# Altium schematic sheet MCU.SchDoc
size A4; Date: 22.07.2025; CheckedBy: Own Checked; CompanyName: No Company; DocumentNumber: ELK.PCB.0001.0001.A.A; Revision: V0.0.1; SheetNumber: 4; SheetTotal: 5
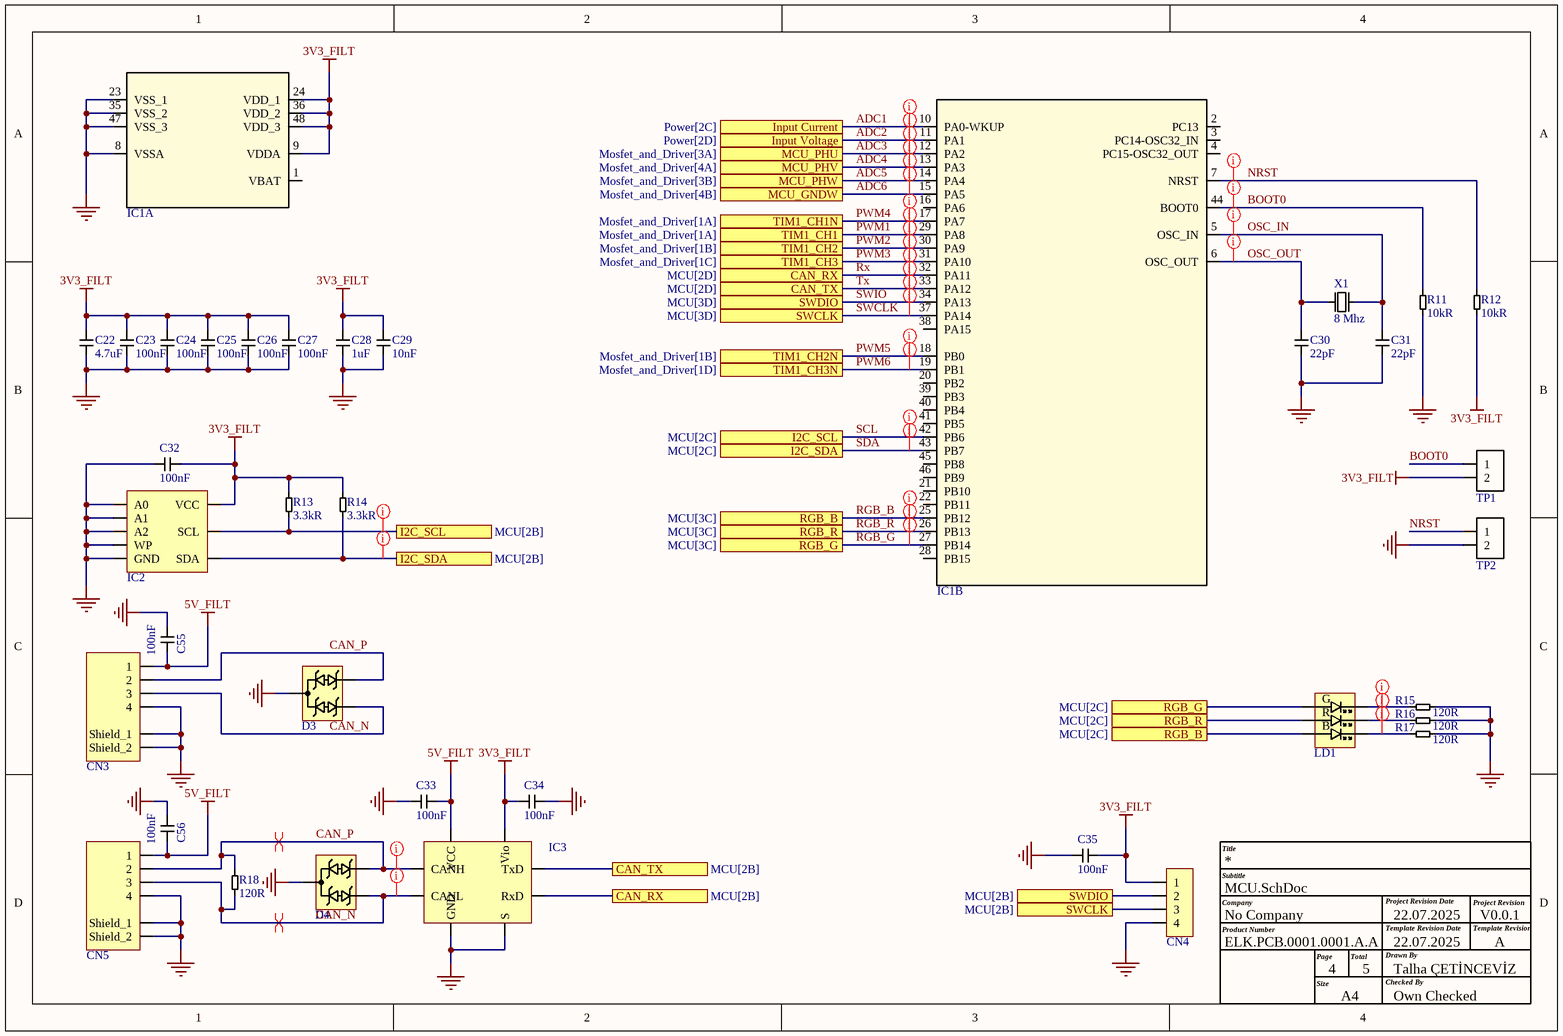
[diagram p0: MCU.SchDoc]

## Parts
C22  value 4.7uF  [CAP 0603]  (hidden comment: CL10A475KO8NNNC)
C23  value 100nF  [CAP 0603]  (hidden comment: CC0603KRX7R9BB104)
C24  value 100nF  [CAP 0603]  (hidden comment: CC0603KRX7R9BB104)
C25  value 100nF  [CAP 0603]  (hidden comment: CC0603KRX7R9BB104)
C26  value 100nF  [CAP 0603]  (hidden comment: CC0603KRX7R9BB104)
C27  value 100nF  [CAP 0603]  (hidden comment: CC0603KRX7R9BB104)
C28  value 1uF  [CAP 0603]  (hidden comment: CL10B105KO8NNNC)
C29  value 10nF  [CAP 0603]  (hidden comment: CL10B103KB8NNNC)
C30  value 22pF  [CAP 0603]  (hidden comment: MCF03JTN500220)
C31  value 22pF  [CAP 0603]  (hidden comment: MCF03JTN500220)
C32  value 100nF  [CAP 0603]  (hidden comment: CC0603KRX7R9BB104)
C33  value 100nF  [CAP 0603]  (hidden comment: CC0603KRX7R9BB104)
C34  value 100nF  [CAP 0603]  (hidden comment: CC0603KRX7R9BB104)
C35  value 100nF  [CAP 0603]  (hidden comment: CC0603KRX7R9BB104)
C55  value 100nF  [CAP 0603]  (hidden comment: CC0603KRX7R9BB104)
C56  value 100nF  [CAP 0603]  (hidden comment: CC0603KRX7R9BB104)
CN3  5024940470  [5024940470]  (value not drawn)
CN4  4 Pin SMD  [4Pin SMD]  (value not drawn)  (no BOM)
CN5  5024940470  [5024940470]  (value not drawn)
D3  PESD1CAN-HT  [SOT23-3]  (value not drawn)
D4  PESD1CAN-HT  [SOT23-3]  (value not drawn)
IC1  STM32F103CBT7TR  [LQFP-48]  (value not drawn)  (parts A,B of 2)
IC2  AT24C128C-SSHM-T  [SOIC-8]  (value not drawn)
IC3  TJA1051T/3,118  [SOIC-8]  (value not drawn)
LD1  HLAF5060H248BS36FU76GCS1  [LED 5050]  (value not drawn)
R11  value 10kR  [RES 0603]  (hidden comment: RC0603FR-0710KL)
R12  value 10kR  [RES 0603]  (hidden comment: RC0603FR-0710KL)
R13  value 3.3kR  [RES 0603]  (hidden comment: 0603SAF3301T5E)
R14  value 3.3kR  [RES 0603]  (hidden comment: 0603SAF3301T5E)
R15  value 120R  [RES 0603]  (hidden comment: 0603SAF1200T5E)
R16  value 120R  [RES 0603]  (hidden comment: 0603SAF1200T5E)
R17  value 120R  [RES 0603]  (hidden comment: 0603SAF1200T5E)
R18  value 120R  [RES 0603]  (hidden comment: 0603SAF1200T5E)
TP1  TP_Mini  [TP]  (value not drawn)  (no BOM)
TP2  TP_Mini  [TP]  (value not drawn)  (no BOM)
X1  value 8 Mhz  [HC-49/US]  (hidden comment: AS-8.000-16-SMD-TR)

## Ports
CAN_RX (see MCU[2B]), CAN_RX (see MCU[2D]), CAN_TX (see MCU[2B]), CAN_TX (see MCU[2D]), I2C_SCL (see MCU[2B]), I2C_SCL (see MCU[2C]), I2C_SDA (see MCU[2B]), I2C_SDA (see MCU[2C]), Input Current (see Power[2C]), Input Voltage (see Power[2D]), MCU_GNDW (see Mosfet_and_Driver[4B]), MCU_PHU (see Mosfet_and_Driver[3A]), MCU_PHV (see Mosfet_and_Driver[4A]), MCU_PHW (see Mosfet_and_Driver[3B]), RGB_B (see MCU[2C]), RGB_B (see MCU[3C]), RGB_G (see MCU[2C]), RGB_G (see MCU[3C]), RGB_R (see MCU[2C]), RGB_R (see MCU[3C]), SWCLK (see MCU[2B]), SWCLK (see MCU[3D]), SWDIO (see MCU[2B]), SWDIO (see MCU[3D]), TIM1_CH1 (see Mosfet_and_Driver[1A]), TIM1_CH1N (see Mosfet_and_Driver[1A]), TIM1_CH2 (see Mosfet_and_Driver[1B]), TIM1_CH2N (see Mosfet_and_Driver[1B]), TIM1_CH3 (see Mosfet_and_Driver[1C]), TIM1_CH3N (see Mosfet_and_Driver[1D])

## Nets
3V3_FILT: C22.2 C23.2 C24.2 C25.2 C26.2 C27.2 C28.2 C29.2 C32.1 C34.2 C35.1 CN4.1 IC1.9(VDDA) IC1.24(VDD_1) IC1.36(VDD_2) IC1.48(VDD_3) IC2.8(VCC) IC3.5(Vio) R12.1 R13.2 R14.2 TP1.2
5V_FILT: C33.1 C55.2 C56.2 CN3.1 CN5.1 IC3.3(VCC)
GND: C22.1 C23.1 C24.1 C25.1 C26.1 C27.1 C28.1 C29.1 C30.1 C31.1 C32.2 C33.2 C34.1 C35.2 C55.1 C56.1 CN3.4 CN3.5(Shield_1) CN3.6(Shield_2) CN4.4 CN5.4 CN5.5(Shield_1) CN5.6(Shield_2) D3.3 D4.3 IC1.8(VSSA) IC1.23(VSS_1) IC1.35(VSS_2) IC1.47(VSS_3) IC2.1(A0) IC2.2(A1) IC2.3(A2) IC2.4(GND) IC2.7(WP) IC3.2(GND) IC3.8(S) R11.1 R15.2 R16.2 R17.2 TP2.2
ADC1: IC1.10(PA0-WKUP) ; port Input Current
ADC2: IC1.11(PA1) ; port Input Voltage
ADC3: IC1.12(PA2) ; port MCU_PHU
ADC4: IC1.13(PA3) ; port MCU_PHV
ADC5: IC1.14(PA4) ; port MCU_PHW
ADC6: IC1.15(PA5) ; port MCU_GNDW
BOOT0: IC1.44(BOOT0) R11.2 TP1.1
CAN_N: CN3.3 CN5.3 D3.2 D4.2 IC3.6(CANL) R18.1
CAN_P: CN3.2 CN5.2 D3.1 D4.1 IC3.7(CANH) R18.2
NRST: IC1.7(NRST) R12.2 TP2.1
OSC_IN: C31.2 IC1.5(OSC_IN) X1.2
OSC_OUT: C30.2 IC1.6(OSC_OUT) X1.1
PWM1: IC1.29(PA8) ; port TIM1_CH1
PWM2: IC1.30(PA9) ; port TIM1_CH2
PWM3: IC1.31(PA10) ; port TIM1_CH3
PWM4: IC1.17(PA7) ; port TIM1_CH1N
PWM5: IC1.18(PB0) ; port TIM1_CH2N
PWM6: IC1.19(PB1) ; port TIM1_CH3N
RGB_B: IC1.25(PB12) LD1.3(Blue_Anode) ; port RGB_B
RGB_G: IC1.27(PB14) LD1.1(Green_Anode) ; port RGB_G
RGB_R: IC1.26(PB13) LD1.2(Red_Anode) ; port RGB_R
Rx: IC1.32(PA11) IC3.4(RxD) ; port CAN_RX
SCL: IC1.42(PB6) IC2.6(SCL) R13.1 ; port I2C_SCL
SDA: IC1.43(PB7) IC2.5(SDA) R14.1 ; port I2C_SDA
SWCLK: CN4.3 IC1.37(PA14) ; port SWCLK
SWIO: CN4.2 IC1.34(PA13) ; port SWDIO
Tx: IC1.33(PA12) IC3.1(TxD) ; port CAN_TX
NetLD1_4: LD1.4(Blue_Cathode) R17.1
NetLD1_5: LD1.5(Red_Cathode) R16.1
NetLD1_6: LD1.6(Green_Cathode) R15.1

Not connected (* = marked no-connect by the designer): IC1 1(VBAT) 2(PC13) 3(PC14-OSC32_IN) 4(PC15-OSC32_OUT) 16(PA6) 20(PB2) 21(PB10) 22(PB11) 28(PB15) 38(PA15) 39(PB3) 40(PB4) 41(PB5) 45(PB8) 46(PB9)

## Layout directives
differential pair: CAN_N, CAN_P
net class 3V3: ADC1, ADC2, ADC3, ADC4, ADC5, ADC6, BOOT0, CAN_N, CAN_P, NetLD1_4, NetLD1_5, NetLD1_6, NRST, OSC_IN, OSC_OUT, PWM1, PWM2, PWM3, PWM4, PWM5, PWM6, RGB_B, RGB_G, RGB_R, Rx, Tx
net class I2C: SCL, SDA, SWCLK, SWIO

## Notes on the sheet
- Title
- Company
- Product Number
- Subtitle
- Project Revision Date
- Template Revision Date
- Project Revision
- Template Revision
- Size
- Page
- A4
- Total
- Checked By
- Drawn By
- 22.07.2025
- Talha ÇETİNCEVİZ
- A
- (in symbol HLAF5060H248BS36FU76GCS1) G; R; B

## Library data of the parts
C22 = CL10A475KO8NNNC: 16V 4.7uF X5R ±10% 0603 Multilayer Ceramic Capacitors MLCC - SMD/SMT ROHS; Manufacturer: Samsung; Supplier: Ozdisan; Supplier Part Number: CL10A475KO8NNNC; Manufacturer Part Number: CL10A475KO8NNNC; RoHS: Yes; Category: Ceramic Capacitors; Stock: 132000; Pricing: 4000=0,0122, 8000=0,01188, 16000=0,01148, 24000=0,01109, 32000=0,01069 (USD); Mounting Technology: Surface Mount; Case/Package: 0603; Case Code (Metric): 1608; Case Code (Imperial): 0603; Material: Ceramic; Min Operating Temperature: -55°C; Max Operating Temperature: 85°C; Tolerance: 10%; Packaging: Tape and Reel; Voltage Rating: 16V; Dielectric: X5R; Voltage: 16V; Series: CL; Construction: Flat; Voltage Rating (DC): 16V; Length: 1.6mm; Height: 0.8mm; Depth: 0.8mm; Radiation Hardening: No; RoHS Compliant: Yes; ComponentLink1URL: https://datasheet.ciiva.com/25795/cl10a475ko8nnnc-25795890.pdf?src-supplier=Digikey; ComponentLink1Description: https://datasheet.ciiva.com/25795/cl10a475ko8nnnc-25795890.pdf?src-supplier=Digikey; ComponentLink2URL: https://datasheet.ciiva.com/26838/getdatasheetpartid-358619-26838383.pdf?src-supplier=Verical; ComponentLink2Description: https://datasheet.ciiva.com/26838/getdatasheetpartid-358619-26838383.pdf?src-supplier=Verical; ComponentLink3URL: https://datasheet.ciiva.com/29198/457663-da-01-en-vs-kondensator-0603-29198671.pdf?src-supplier=Conrad; ComponentLink3Description: https://datasheet.ciiva.com/29198/457663-da-01-en-vs-kondensator-0603-29198671.pdf?src-supplier=Conrad
C23-C27 C32-C35 C55 C56 = CC0603KRX7R9BB104: Multilayer Ceramic Capacitor, CC Series, 0.1 - F, - 10%, X7R, 50 V, 0603 [1608 Metric]; Manufacturer: Yageo; Dielectric Material: 4241ConductorMaterial; Voltage Rating: 50V; Supplier: Ozdisan; Supplier Part Number: CC0603KRX7R9BB104; Manufacturer Part Number: CC0603KRX7R9BB104; RoHS: Yes; Category: Ceramic Capacitors; Stock: 5600000; Pricing: 4000=0,0018, 20000=0,0017, 80000=0,0017, 200000=0,0016, 500000=0,0015 (USD); Mounting Technology: Surface Mount; Case/Package: 0603; Pins: 2; Case Code (Metric): 1608; Case Code (Imperial): 0603; Material: 4241ConductorMaterial; Min Operating Temperature: -55°C; Max Operating Temperature: 125°C; Tolerance: 10%; Dielectric: X7R; Termination: SMD/SMT; Voltage: 50V; Package Quantity: 1; Packaging: Tape and Reel; Series: CC; Length: 0.063inch; Width: 0.031inch; Height: 0.8mm; Thickness: 0.035inch; Depth: 0.8mm; Radiation Hardening: No; Reach SVHC Compliant: No; Lead Free: 5697LeadFree; Halogen Free: 5694HalogenFree; RoHS Compliant: Yes; ComponentLink1URL: https://datasheet.ciiva.com/11786/0900766b80d84f1d-11786061.pdf?src-supplier=Rs; ComponentLink1Description: https://datasheet.ciiva.com/11786/0900766b80d84f1d-11786061.pdf?src-supplier=Rs; ComponentLink2URL: https://datasheet.ciiva.com/8033/70765-8033821.pdf?src-supplier=Element14; ComponentLink2Description: https://datasheet.ciiva.com/8033/70765-8033821.pdf?src-supplier=Element14; ComponentLink3URL: https://datasheet.ciiva.com/7978/1489800-7978166.pdf?src-supplier=Element14; ComponentLink3Description: https://datasheet.ciiva.com/7978/1489800-7978166.pdf?src-supplier=Element14; ComponentLink4URL: https://datasheet.ciiva.com/144/mlccorderingcode-144177.pdf?src-supplier=Digikey; ComponentLink4Description: https://datasheet.ciiva.com/144/mlccorderingcode-144177.pdf?src-supplier=Digikey; ComponentLink5URL: https://datasheet.ciiva.com/144/mlccorderingcode-144176.pdf?src-supplier=Digikey; ComponentLink5Description: https://datasheet.ciiva.com/144/mlccorderingcode-144176.pdf?src-supplier=Digikey; ComponentLink6URL: https://datasheet.ciiva.com/144/mlccorderingcode-144178.pdf?src-supplier=Digikey; ComponentLink6Description: https://datasheet.ciiva.com/144/mlccorderingcode-144178.pdf?src-supplier=Digikey; ComponentLink7URL: https://datasheet.ciiva.com/8033/70765-8033819.pdf?src-supplier=Element14; ComponentLink7Description: https://datasheet.ciiva.com/8033/70765-8033819.pdf?src-supplier=Element14; ComponentLink8URL: https://datasheet.ciiva.com/31394/1489800-31394927.pdf?src-supplier=Farnell; ComponentLink8Description: https://datasheet.ciiva.com/31394/1489800-31394927.pdf?src-supplier=Farnell; ComponentLink9URL: https://datasheet.ciiva.com/22749/1489800-22749214.pdf?src-supplier=Element14; ComponentLink9Description: https://datasheet.ciiva.com/22749/1489800-22749214.pdf?src-supplier=Element14
C28 = CL10B105KO8NNNC: 16V 1uF X7R ±10% 0603 Multilayer Ceramic Capacitors MLCC - SMD/SMT ROHS; Manufacturer: Samsung; Supplier: Ozdisan; Supplier Part Number: CL10B105KO8NNNC; Manufacturer Part Number: CL10B105KO8NNNC; RoHS: Yes; Category: Ceramic Capacitors; Stock: 3916000; Pricing: 4000=0,00524, 8000=0,0051, 16000=0,00394, 24000=0,00476, 32000=0,00459 (USD); Mounting Technology: Surface Mount; Case/Package: 0603; Case Code (Metric): 1608; Case Code (Imperial): 0603; Material: Ceramic; Min Operating Temperature: -55°C; Max Operating Temperature: 125°C; Packaging: Tape and Reel; Tolerance: 10%; Voltage Rating: 16V; Dielectric: X7R; Voltage: 16V; Series: CL; Construction: Flat; Voltage Rating (DC): 16V; Length: 1.6mm; Width: 0.031inch; Height: 0.8mm; Thickness: 0.035inch; Depth: 0.8mm; Radiation Hardening: No; RoHS Compliant: Yes; Lead Free: 5697LeadFree; ComponentLink1URL: https://datasheet.ciiva.com/15195/getdatasheetpartid-357418-15195728.pdf?src-supplier=Verical; ComponentLink1Description: https://datasheet.ciiva.com/15195/getdatasheetpartid-357418-15195728.pdf?src-supplier=Verical; ComponentLink2URL: https://datasheet.ciiva.com/29198/458176-da-01-en-vs-kondensator-0603-29198478.pdf?src-supplier=Conrad; ComponentLink2Description: https://datasheet.ciiva.com/29198/458176-da-01-en-vs-kondensator-0603-29198478.pdf?src-supplier=Conrad
C29 = CL10B103KB8NNNC: 50V 10nF X7R ±10% 0603 Multilayer Ceramic Capacitors MLCC - SMD/SMT ROHS; Manufacturer: Samsung; Supplier: Ozdisan; Supplier Part Number: CL10B103KB8NNNC; Manufacturer Part Number: CL10B103KB8NNNC; RoHS: Yes; Category: Ceramic Capacitors; Stock: 2448000; Pricing: 4000=0,00299, 8000=0,00291, 16000=0,00281, 24000=0,00272, 32000=0,00262 (USD); Mounting Technology: Surface Mount; Case/Package: 0603; Case Code (Metric): 1608; Case Code (Imperial): 0603; Material: Ceramic; Min Operating Temperature: -55°C; Max Operating Temperature: 125°C; Tolerance: 10%; Dielectric: X7R; Voltage: 50V; Voltage Rating (DC): 50V; Voltage Rating: 50V; Package Quantity: 1; Packaging: Tape and Reel; Series: CL; Construction: Flat; Length: 1.6mm; Width: 0.031inch; Height: 0.8mm; Depth: 0.8mm; Thickness: 0.035inch; Radiation Hardening: No; Lead Free: 5697LeadFree; RoHS Compliant: Yes; ComponentLink1URL: https://datasheet.ciiva.com/15195/getdatasheetpartid-357415-15195721.pdf?src-supplier=Verical; ComponentLink1Description: https://datasheet.ciiva.com/15195/getdatasheetpartid-357415-15195721.pdf?src-supplier=Verical; ComponentLink2URL: https://datasheet.ciiva.com/29198/457455-da-01-en-vs-kondensator-0603-29198644.pdf?src-supplier=Conrad; ComponentLink2Description: https://datasheet.ciiva.com/29198/457455-da-01-en-vs-kondensator-0603-29198644.pdf?src-supplier=Conrad
C30 C31 = MCF03JTN500220: MLCC (1608) 0603 22pF 50VDC ±5% C0G (NP0); Manufacturer: VIKING; Voltage Rating: 50V; Supplier: Ozdisan; Supplier Part Number: MCF03JTN500220; Manufacturer Part Number: MCF03JTN500220; RoHS: Yes; Category: Ceramic Capacitors; Mounting Technology: Surface Mount; Case/Package: 0603; Case Code (Metric): 1608; Case Code (Imperial): 0603; Min Operating Temperature: -55°C; Max Operating Temperature: 125°C; Package Quantity: 1; Packaging: Tape and Reel; Tolerance: 5%; Dielectric: C0G; Voltage Rating (DC): 50V; ComponentLink1URL: https://datasheet.ciiva.com/25724/cl31b226kphnnne-25724443.pdf?src-supplier=Digikey; ComponentLink1Description: https://datasheet.ciiva.com/25724/cl31b226kphnnne-25724443.pdf?src-supplier=Digikey; ComponentLink2URL: https://datasheet.ciiva.com/16384/cl31b226kphnnne-16384588.pdf?src-supplier=Future+Electronics; ComponentLink2Description: https://datasheet.ciiva.com/16384/cl31b226kphnnne-16384588.pdf?src-supplier=Future+Electronics; ComponentLink3URL: https://datasheet.ciiva.com/26838/getdatasheetpartid-710483-26838941.pdf?src-supplier=Verical; ComponentLink3Description: https://datasheet.ciiva.com/26838/getdatasheetpartid-710483-26838941.pdf?src-supplier=Verical
CN3 CN5 = 5024940470: 2.00mm Pitch CLIK-Mate Wire-to-Board PCB Receptacle, Single Row, Right-Angle, 4 Circuits; Manufacturer: Molex; Glow Wire Compliant: 16Compliance; Plating: 154ConductorMaterial; Voltage Rating: 250V; Supplier: Digikey; Supplier Part Number: WM2282TR-ND; Manufacturer Part Number: 5024940470; RoHS: Yes; Category: Headers and Wire Housings; Stock: 15226; Pricing: 1=0,89, 10=0,759, 50=0,759, 100=0,645, 1000=0,553, 10000=0,526 (USD); ComponentLink1URL: https://datasheet.ciiva.com/756/5025840260-sd-756786.pdf?src-supplier=Digikey; ComponentLink1Description: https://datasheet.ciiva.com/756/5025840260-sd-756786.pdf?src-supplier=Digikey; ComponentLink2URL: https://datasheet.ciiva.com/5162/5025840460-pcb-receptacles-179457-5162146.pdf?src-supplier=Mouser; ComponentLink2Description: https://datasheet.ciiva.com/5162/5025840460-pcb-receptacles-179457-5162146.pdf?src-supplier=Mouser; ComponentLink3URL: https://datasheet.ciiva.com/16104/162295025840460-pcb-receptacles-16104761.pdf?src-supplier=Onlinecomponents.com; ComponentLink3Description: https://datasheet.ciiva.com/16104/162295025840460-pcb-receptacles-16104761.pdf?src-supplier=Onlinecomponents.com; ComponentLink4URL: https://datasheet.ciiva.com/10088/5025840460-pcb-receptacles-10088973.pdf?src-supplier=Avnet; ComponentLink4Description: https://datasheet.ciiva.com/10088/5025840460-pcb-receptacles-10088973.pdf?src-supplier=Avnet; Min Operating Temperature: -40°C; Max Operating Temperature: 105°C; ComponentLink5URL: https://datasheet.ciiva.com/755/5024940470-sd-755843.pdf?src-supplier=Digikey; ComponentLink5Description: https://datasheet.ciiva.com/755/5024940470-sd-755843.pdf?src-supplier=Digikey; ComponentLink6URL: https://datasheet.ciiva.com/10088/5024940470-pcb-receptacles-10088784.pdf?src-supplier=Avnet; ComponentLink6Description: https://datasheet.ciiva.com/10088/5024940470-pcb-receptacles-10088784.pdf?src-supplier=Avnet; ComponentLink7URL: https://datasheet.ciiva.com/7436/60379-7436280.pdf?src-supplier=Newark; ComponentLink7Description: https://datasheet.ciiva.com/7436/60379-7436280.pdf?src-supplier=Newark; ComponentLink8URL: https://datasheet.ciiva.com/7436/1630853-7436281.pdf?src-supplier=Newark; ComponentLink8Description: https://datasheet.ciiva.com/7436/1630853-7436281.pdf?src-supplier=Newark; ComponentLink9URL: https://datasheet.ciiva.com/5159/5024940470-pcb-receptacles-179384-5159396.pdf?src-supplier=Mouser; ComponentLink9Description: https://datasheet.ciiva.com/5159/5024940470-pcb-receptacles-179384-5159396.pdf?src-supplier=Mouser; ComponentLink10URL: https://datasheet.ciiva.com/755/5024940470-sd-755780.pdf?src-supplier=Digikey; ComponentLink10Description: https://datasheet.ciiva.com/755/5024940470-sd-755780.pdf?src-supplier=Digikey; ComponentLink11URL: https://datasheet.ciiva.com/755/5024940470-sd-755788.pdf?src-supplier=Digikey; ComponentLink11Description: https://datasheet.ciiva.com/755/5024940470-sd-755788.pdf?src-supplier=Digikey; ComponentLink12URL: https://datasheet.ciiva.com/10088/5024940470-pcb-receptacles-10088971.pdf?src-supplier=Avnet; ComponentLink12Description: https://datasheet.ciiva.com/10088/5024940470-pcb-receptacles-10088971.pdf?src-supplier=Avnet; ComponentLink13URL: https://datasheet.ciiva.com/9468/5024940470-pcb-receptacles-9468056.pdf?src-supplier=Avnet; ComponentLink13Description: https://datasheet.ciiva.com/9468/5024940470-pcb-receptacles-9468056.pdf?src-supplier=Avnet; ComponentLink14URL: https://datasheet.ciiva.com/7843/1630853-7843997.pdf?src-supplier=Element14; ComponentLink14Description: https://datasheet.ciiva.com/7843/1630853-7843997.pdf?src-supplier=Element14
D3 D4 = PESD1CAN-HT: DIODE TVS 200W 24V SOT23; Manufacturer: Nexperia; Manufacturer Part Number: PESD1CAN-UX; Clamping Voltage: 35V; Breakdown Voltage: 25.4V; Direction: 211Direction; Peak Pulse Current: 1A; Peak Pulse Power: 150W; Value: 9.3pF; Number of Channels: 1NUMBER; Leakage Current: 50nA; Number of Bidirectional Channels: 2NUMBER; Power Line Protection: 5898YesNo; Element Configuration: 5461ElementConfiguration; Supplier: Ozdisan; Supplier Part Number: PESD1CAN-HT; RoHS: No; Category: ESD and Circuit Protection ICs; Stock: 492000; Pricing: 3000=0,0833, 6000=0,082, 12000=0,0806, 15000=0,0802, 45000=0,0776 (USD); Mounting Technology: 8Mount; Case/Package: 966Case; Pins: 70NUMBER; Contact Plating: 154ConductorMaterial; Min Operating Temperature: -55°C; Max Operating Temperature: 150°C; Packaging: 13Packaging; Polarity: 211Direction; Min Breakdown Voltage: 25.4V; Reverse Standoff Voltage: 24V; Working Voltage: 24V; Operating Supply Voltage: 35V; Termination: 4890ConnectorType; Length: 2.2mm; Height: 1.1mm; Depth: 1.35mm; Radiation Hardening: 5898YesNo; Lead Free: 5697LeadFree; ComponentLink1URL: http://www.farnell.com/datasheets/1738911.pdf?src-supplier=Farnell; ComponentLink1Description: http://www.farnell.com/datasheets/1738911.pdf?src-supplier=Farnell; ComponentLink2URL: https://www.mouser.com/ds/2/302/PESD1CAN-U-1151714.pdf?src-supplier=Mouser; ComponentLink2Description: https://www.mouser.com/ds/2/302/PESD1CAN-U-1151714.pdf?src-supplier=Mouser; ComponentLink3URL: http://www.farnell.com/datasheets/1738911.pdf?src-supplier=Element14; ComponentLink3Description: http://www.farnell.com/datasheets/1738911.pdf?src-supplier=Element14; ComponentLink4URL: https://datasheet.octopart.com/PESD1CAN-UX-Nexperia-datasheet-14741084.pdf?src-supplier=Newark; ComponentLink4Description: https://datasheet.octopart.com/PESD1CAN-UX-Nexperia-datasheet-14741084.pdf?src-supplier=Newark; ComponentLink5URL: http://www.farnell.com/datasheets/1738911.pdf?src-supplier=Newark; ComponentLink5Description: http://www.farnell.com/datasheets/1738911.pdf?src-supplier=Newark; ComponentLink6URL: https://assets.nexperia.com/documents/data-sheet/PESD1CAN-U.pdf?src-supplier=Digikey; ComponentLink6Description: https://assets.nexperia.com/documents/data-sheet/PESD1CAN-U.pdf?src-supplier=Digikey; ComponentLink7URL: https://datasheet.octopart.com/PESD1CAN-UX-Nexperia-datasheet-87844164.pdf?src-supplier=LKR; ComponentLink7Description: https://datasheet.octopart.com/PESD1CAN-UX-Nexperia-datasheet-87844164.pdf?src-supplier=LKR; ComponentLink8URL: https://datasheet.octopart.com/PESD1CAN-UX-Nexperia-datasheet-87844164.pdf?src-supplier=TME; ComponentLink8Description: https://datasheet.octopart.com/PESD1CAN-UX-Nexperia-datasheet-87844164.pdf?src-supplier=TME
IC1 = STM32F103CBT7TR: RISC Microcontroller, 32-Bit, FLASH, CORTEX-M3 CPU, 1.25MHz, CMOS, PQFP48; Manufacturer: STMicroelectronics; RAM Size: 20KB; Max Power Dissipation: 363mW; Interface: I2C,SPI,USB,IrDA,UART,USART,CAN; Number of I/Os: 37; Number of Timers/Counters: 4; Min Supply Voltage: 2V; Data Bus Width: 32b; Oscillator Type: Internal; Watchdog Timer: Yes; Clock Frequency: 72MHz; Memory Size: 128KB; Peripherals: POR,PWM,WDT,DMA,Temp Sensor; Core Architecture: ARM; Operating Supply Voltage: 3.6V; Supplier: Ozdisan; Supplier Part Number: 511-STM32F103CBT7TR; Manufacturer Part Number: STM32F103CBT7TR; RoHS: Yes; Category: Microcontrollers; Pricing: 1=9,08, 10=6,8, 50=6,49, 100=5,63, 1000=4,22, 10000=4,22 (USD); Case/Package: LQFP-48; Pins: 48; Min Operating Temperature: -40°C; Max Operating Temperature: 105°C; Package Quantity: 2400; Packaging: Tape and Reel; Number of Programmable I/O: 37; Memory Format: FLASH; Series: STM32F1; Radiation Hardening: No; RoHS Compliant: Yes; ComponentLink1URL: https://datasheet.ciiva.com/12271/cd00161566-12271942.pdf?src-supplier=Mouser; ComponentLink1Description: https://datasheet.ciiva.com/12271/cd00161566-12271942.pdf?src-supplier=Mouser
IC2 = AT24C128C-SSHM-T: AT24C128C-SSHM-T, ATMEL, EEPROM Serial-2Wire 128K-bit 16K x 8 2.5V/3.3V/5V8-Pin SOIC; Manufacturer: Microchip; Supplier: Ozdisan; Supplier Part Number: AT24C128C-SSHM-T; Manufacturer Part Number: AT24C128C-SSHM-T; RoHS: Yes; Category: EEPROM; Stock: 11205; Pricing: 1=0,469, 25=0,411, 100=0,34, 4000=0,305 (EUR); ComponentLink1URL: https://datasheet.ciiva.com/15123/getdatasheetpartid-326995-15123397.pdf?src-supplier=Verical; ComponentLink1Description: https://datasheet.ciiva.com/15123/getdatasheetpartid-326995-15123397.pdf?src-supplier=Verical; ComponentLink2URL: https://datasheet.ciiva.com/24168/at24c128c-sshm-t-24168473.pdf?src-supplier=Future+Electronics; ComponentLink2Description: https://datasheet.ciiva.com/24168/at24c128c-sshm-t-24168473.pdf?src-supplier=Future+Electronics; ComponentLink3URL: https://datasheet.ciiva.com/6615/atmel-8734-seeprom-at24c128c-datasheet-6615863.pdf?src-supplier=Digikey; ComponentLink3Description: https://datasheet.ciiva.com/6615/atmel-8734-seeprom-at24c128c-datasheet-6615863.pdf?src-supplier=Digikey; ComponentLink4URL: https://datasheet.ciiva.com/6615/atmel-8734-seeprom-at24c128c-datasheet-6615864.pdf?src-supplier=Digikey; ComponentLink4Description: https://datasheet.ciiva.com/6615/atmel-8734-seeprom-at24c128c-datasheet-6615864.pdf?src-supplier=Digikey; ComponentLink5URL: https://datasheet.ciiva.com/18617/atmel-8734-seeprom-at24c128c-datasheet-18617913.pdf?src-supplier=Digikey; ComponentLink5Description: https://datasheet.ciiva.com/18617/atmel-8734-seeprom-at24c128c-datasheet-18617913.pdf?src-supplier=Digikey; ComponentLink6URL: https://datasheet.ciiva.com/22729/1726559-22729494.pdf?src-supplier=Element14; ComponentLink6Description: https://datasheet.ciiva.com/22729/1726559-22729494.pdf?src-supplier=Element14; Case/Package: SOIC-8; Min Operating Temperature: -40°C; Max Operating Temperature: 85°C
IC3 = TJA1051T/3,118: TJA1051 Series 3 V 1 Mbit/s Surface Mount High-Speed CAN Transceiver - SOIC-8; Manufacturer: NXP Semiconductors; Propagation Delay: 250ns; Data Rate: 1Mbps; Min Supply Voltage: 4.5V; Max Supply Voltage: 5.5V; Number of Transceivers: 1; Quiescent Current: 10A; Supply Current: 70mA; Number of Circuits: 1NUMBER; Supplier: Ozdisan; Supplier Part Number: TJA1051T/3,118; Manufacturer Part Number: TJA1051T/3,118; RoHS: Yes; Category: Interface ICs; Stock: 28742; Pricing: 1=1,34, 10=0,978, 50=0,886, 100=0,786, 250=0,737, 500=0,709, 1000=0,66, 2500=0,636 (EUR); Mounting Technology: Surface Mount; Case/Package: SOIC-8; Pins: 8; Min Operating Temperature: -40°C; Max Operating Temperature: 125°C; Packaging: Tape and Reel; Package Quantity: 2500; Interface: CAN; Turn-On Delay Time: 250ns; Channels: 1; Nominal Supply Voltage: 5.5V; Length: 4.9mm; Width: 3.9mm; Height: 1.75mm; Height - Seated (Max): 1.75mm; Terminal Pitch: 1.27mm; Radiation Hardening: No; RoHS Compliant: Yes; Lead Free: 5697LeadFree; Reach SVHC Compliant: 4188SVHC; ComponentLink1URL: https://datasheet.ciiva.com/4781/tja1051-119511-4781411.pdf?src-supplier=Mouser; ComponentLink1Description: https://datasheet.ciiva.com/4781/tja1051-119511-4781411.pdf?src-supplier=Mouser; ComponentLink2URL: https://datasheet.ciiva.com/11212/tja1051-11212760.pdf?src-supplier=Avnet; ComponentLink2Description: https://datasheet.ciiva.com/11212/tja1051-11212760.pdf?src-supplier=Avnet; ComponentLink3URL: https://datasheet.ciiva.com/16200/tja1051-16200734.pdf?src-supplier=Future+Electronics; ComponentLink3Description: https://datasheet.ciiva.com/16200/tja1051-16200734.pdf?src-supplier=Future+Electronics; ComponentLink4URL: https://datasheet.ciiva.com/15149/getdatasheetpartid-295271-15149995.pdf?src-supplier=Verical; ComponentLink4Description: https://datasheet.ciiva.com/15149/getdatasheetpartid-295271-15149995.pdf?src-supplier=Verical
LD1 = HLAF5060H248BS36FU76GCS1: LED SMD 5050 RGB R:250mcd G:1300mcd B:350mcd@20mA; Manufacturer: Honglitronic; Manufacturer Part Number: HL-AF-5060H248BS36FU76GC-S1-THL; View Angle: 120°; Forward Voltage - Red: 2.0 V; Forward Voltage - Green: 3.0 V; Forward Current - Red: 30mA; Power - Red: 75 mW; Power - Green: 105 mW; Wavelength - Red: 625 nm; Wavelength - Green: 523 nm; Wavelength - Blue: 469 nm; Luminous Intensity - Red: 310 cmd; Luminous Intensity - Green: 1300 cm; Luminous Intensity - Blue: 350 cmd; Category: Led; Min Operating Temperature: -40°C; Max Operating Temperature: 85°C; Color: RGB; Case/Package: 5050; Forward Voltage - Blue: 3.0 V; Forward Current - Green: 30mA; Forward Current - Blue: 30mA; Power - Blue: 105 mW
R11 R12 = RC0603FR-0710KL: SMD Chip Resistor, 10 Kohm, ½ 1%, 100 Mw, 0603 [1608 Metric], Thick Film, General Purpose; Manufacturer: Yageo; Voltage Rating (DC): 50V; Temperature Coefficient: 100ppm/°C; Voltage Rating: 75V; Power Rating: 100mW; Supplier: Ozdisan; Supplier Part Number: RC0603FR-0710KL; Manufacturer Part Number: RC0603FR-0710KL; RoHS: Yes; Category: Chip SMD Resistors; Stock: 42525000; Pricing: 5000=0,001, 25000=0,001, 150000=0,001, 500000=0,0009, 1500000=0,0009 (USD); Case/Package: 0603; Pins: 2; Case Code (Imperial): 0603; Case Code (Metric): 1608; Weight: 7.1E-05oz; Min Operating Temperature: -55°C; Max Operating Temperature: 155°C; Packaging: Tape and Reel; Tolerance: 1%; Termination: SMD/SMT; Resistor Type: Thick Film; Features: Moisture Resistant; Series: RC; Max Power Dissipation: 100mW; Number of Terminations: 2; Resistance Tolerance: 1%; Construction: Rectangular; Length: 1.6mm; Width: 0.8mm; Height: 0.45mm; Depth: 0.8mm; Lead Pitch: 0.3mm; Reach SVHC Compliant: No; Lead Free: 5697LeadFree; Military Standard: Not; RoHS Compliant: Yes; ComponentLink1URL: https://datasheet.ciiva.com/7660/38590-7660789.pdf?src-supplier=Element14; ComponentLink1Description: https://datasheet.ciiva.com/7660/38590-7660789.pdf?src-supplier=Element14; ComponentLink2URL: https://datasheet.ciiva.com/7983/443971-7983596.pdf?src-supplier=Element14; ComponentLink2Description: https://datasheet.ciiva.com/7983/443971-7983596.pdf?src-supplier=Element14; ComponentLink3URL: https://datasheet.ciiva.com/22747/443971-22747519.pdf?src-supplier=Element14; ComponentLink3Description: https://datasheet.ciiva.com/22747/443971-22747519.pdf?src-supplier=Element14; ComponentLink4URL: https://datasheet.ciiva.com/46440/1868787-46440891.pdf?src-supplier=Element14; ComponentLink4Description: https://datasheet.ciiva.com/46440/1868787-46440891.pdf?src-supplier=Element14; ComponentLink5URL: https://datasheet.ciiva.com/7746/1738695-7746239.pdf?src-supplier=Element14; ComponentLink5Description: https://datasheet.ciiva.com/7746/1738695-7746239.pdf?src-supplier=Element14; ComponentLink6URL: https://datasheet.ciiva.com/15189/getdatasheetpartid-409289-15189591.pdf?src-supplier=Verical; ComponentLink6Description: https://datasheet.ciiva.com/15189/getdatasheetpartid-409289-15189591.pdf?src-supplier=Verical
R13 R14 = 0603SAF3301T5E: Res Thick Film 0603 3.3K Ohm 1% 0.1W(1/10W) ±100ppm/°C Pad SMD T/R; Manufacturer: Multicomp; Manufacturer Part Number: MC0603SAF3301T5E; Power Rating: 100mW; Voltage Rating: 75V; Supplier: Ozdisan; Supplier Part Number: 0603SAF3301T5E; RoHS: Yes; Stock: 40000; Pricing: 10000=0,001 (USD); RoHS Compliant: Yes; ComponentLink1URL: https://datasheet.octopart.com/0603SAF3301T5E-Royal-Ohm-datasheet-165785611.pdf?src-supplier=TME; ComponentLink1Description: https://datasheet.octopart.com/0603SAF3301T5E-Royal-Ohm-datasheet-165785611.pdf?src-supplier=TME; Case Code (Imperial): 0603; Case Code (Metric): 1608; Case/Package: 0603; Category: Resistors; Pins: 2; Packaging: Cut Tape; Resistance Tolerance: 1%; Resistor Type: Thick Film; Temperature Coefficient: 100ppm/°C; Voltage Rating (DC): 75V
R15-R18 = 0603SAF1200T5E: RES.(1608) 0603 120 Ohms 1% 1/10W-S 100PPM; Manufacturer: ROYALOHM; Voltage Rating (DC): 50V; Temperature Coefficient: 100ppm/°C; Voltage Rating: 75V; Power Rating: 100mW; Supplier: Ozdisan; Supplier Part Number: 0603SAF1200T5E; Manufacturer Part Number: 0603SAF1200T5E; RoHS: Yes; Category: Chip SMD Resistors; Case/Package: 0603; Pins: 2; Case Code (Imperial): 0603; Case Code (Metric): 1608; Weight: 7.1E-05oz; Min Operating Temperature: -55°C; Max Operating Temperature: 155°C; Packaging: Tape and Reel; Tolerance: 1%; Termination: SMD/SMT; Resistor Type: Thick Film; Features: Moisture Resistant; Series: RC; Max Power Dissipation: 100mW; Number of Terminations: 2; Resistance Tolerance: 1%; Construction: Rectangular; Length: 1.6mm; Width: 0.8mm; Height: 0.45mm; Depth: 0.8mm; Lead Pitch: 0.3mm
X1 = AS-8.000-16-SMD-TR: CRYSTAL 8MHz HC49SMT 16pF SMD TR RALTRON; Manufacturer: Raltron Electronics; Supplier: Ozdisan; Supplier Part Number: AS-8.000-16-SMD-TR; Manufacturer Part Number: AS-8.000-16-SMD-TR; RoHS: No; Category: Uncategorized; Pricing: 3000=0,1278, 15000=0,1247 (USD); Case/Package: HC-49/US; Min Operating Temperature: -20°C; Max Operating Temperature: 70°C